# Altium schematic sheet SCH10_BBB_USB.SchDoc: Beaglebone Black - USB
size B; Organization: CWRUbotix; Address1: 10900 Euclid Avenue; Address2: Cleveland, OH 44106; Address3: USA; Revision: 1.0; SheetNumber: 10; SheetTotal: 13
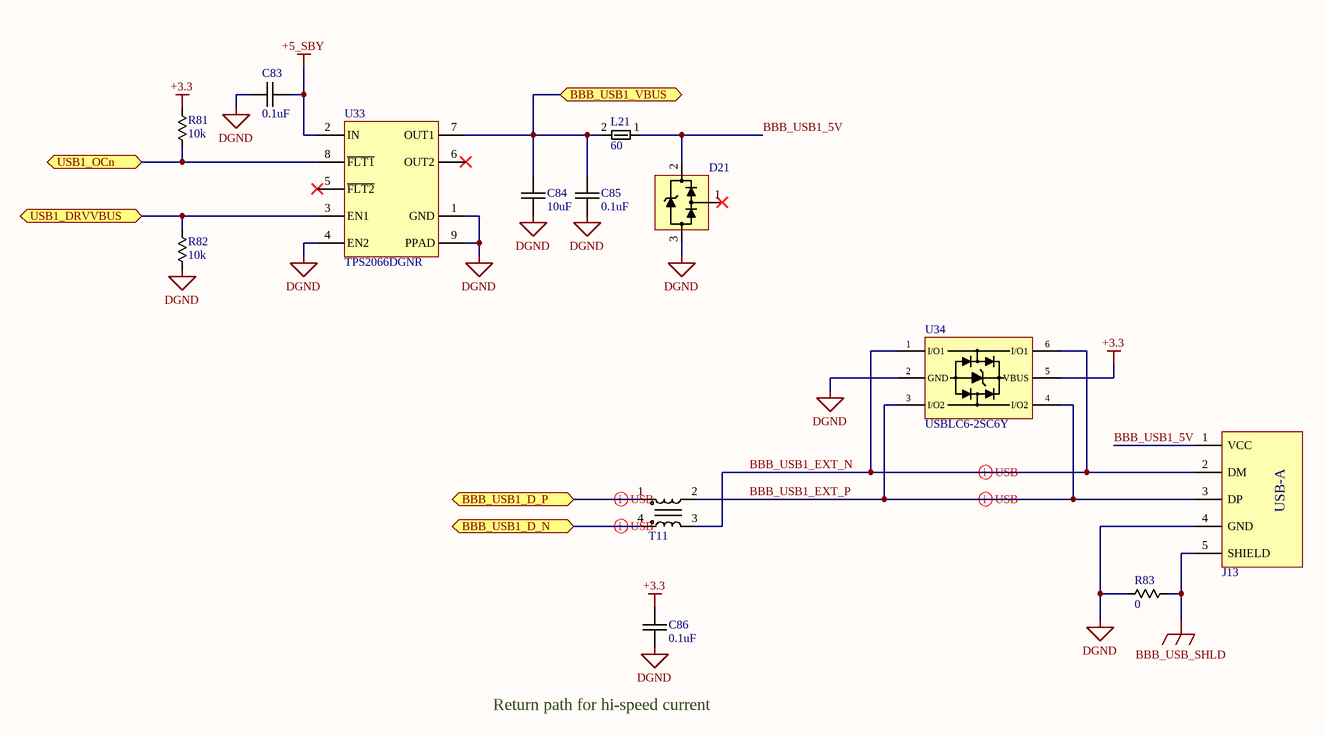
[diagram p0: SCH10_BBB_USB.SchDoc]

## Parts
C83  0.1uF  [chip_0603]
C84  10uF  [chip_1206]
C85  0.1uF  [chip_0603]
C86  0.1uF  [chip_0603]
D21  DLPT05  [sot-23-3]  (value not drawn)
J13  usb_a  [AMPHENOL_87583-3010RPALF]  (value not drawn)
L21  Impedance: 60  [CHIP_0805_FE]  (hidden comment: bead_0)
R81  10k  [chip_0603]
R82  10k  [chip_0603]
R83  0  [chip_0805]
T11  DLW21HN900SQ2L  [MURATA_DLW21H]  (value not drawn)
U33  TPS2066DGNR  [VSSOP-8-PPAD]
U34  USBLC6-2SC6Y  [sot-23-6]

## Ports
BBB_USB1_D_N (bidir), BBB_USB1_D_P (bidir), BBB_USB1_VBUS (bidir), USB1_DRVVBUS (bidir), USB1_OCn (bidir)

## Nets
+3.3: C86.1 R81.1 U34.5(VBUS)
+5_SBY: C83.1 U33.2(IN)
BBB_USB_SHLD: J13.5(SHIELD) R83.2
DGND: C83.2 C84.2 C85.1 C86.2 D21.3(GND) J13.4(GND) R82.2 R83.1 U33.1(GND) U33.4(EN2) U33.9(PPAD) U34.2(GND)
BBB_USB1_5V: D21.2(VCC) J13.1(VCC) L21.1
BBB_USB1_D_N: T11.4 ; port BBB_USB1_D_N
BBB_USB1_D_P: T11.1 ; port BBB_USB1_D_P
BBB_USB1_EXT_N: J13.2(DM) T11.3 U34.1(I/O1) U34.6(I/O1)
BBB_USB1_EXT_P: J13.3(DP) T11.2 U34.3(I/O2) U34.4(I/O2)
BBB_USB1_VBUS: C84.1 C85.2 L21.2 U33.7(OUT1) ; port BBB_USB1_VBUS
USB1_DRVVBUS: R82.1 U33.3(EN1) ; port USB1_DRVVBUS
USB1_OCn: R81.2 U33.8(~{FLT1}) ; port USB1_OCn

Not connected (* = marked no-connect by the designer): D21 1(LINE)*; U33 5(~{FLT2})* 6(OUT2)*

## Layout directives
differential pair: BBB_USB1_D_N, BBB_USB1_D_P, BBB_USB1_EXT_N, BBB_USB1_EXT_P

## Notes on the sheet
- Return path for hi-speed current
- Title
- Size:
- B
- Number:
- Revision:
- Date:
- Sheet
- of
- (in symbol CONN-00123) USB-A

## Library data of the parts
C83 C85 C86 = CAP-00542: CAP, 0.1uF, ±10%, 16V, X7R, 0603; Manufacturer: Murata; Part Number: CAP-00542; Capacitance: 0.1uF; Tolerance: ±10%; Voltage Rating: 16V; Type: X7R
C84 = CAP-00539: CAP, 10uF, ±10%, 25V, X7R, 1206; Manufacturer: Samsung; Manufacturer PN: CL31B106KAHNNNE; Part Number: CAP-00539; Capacitance: 10uF; Tolerance: ±10%; Voltage Rating: 25V; Type: X7R
D21 = DIO-00057: TVS, Steering (Rail-Rail), 9.8V Clamping, 17A Peak Pulse, SOT-23; Manufacturer: Diodes Incorporated; Manufacturer PN: DLPT05-7-F; Reverse Breakdown Voltage: 6.0V; Part Number: DIO-00057; Type: TVS; Cost: 0.38
J13 = CONN-00123: USB-A Receptacle x1, USB 2.0, Right-Angle, SMD; Manufacturer: Amphenol; Manufacturer PN: 87583-3010RPALF; Positions per level: 4; Levels: 1; Part Number: CONN-00123; Type: Receptacle; Cost: 0.89; Distributor Link: https://www.digikey.com/en/products/detail/amphenol-icc-fci/87583-3010RPALF/4266975
L21 = MAG-00125: Fe Bead, 60 @ 100MH, 3A, 0805; Manufacturer: Pulse Electronics; Manufacturer PN: PE-0805PFB600ST; Test Freq: 100MHz; DCR: 25mOhm; Part Number: MAG-00125; Current Rating: 3A; Cost: 0.1
R81 R82 = RES-00306: RES SMD 10K OHM 1% 1/4W 0603; Manufacturer: Panasonic; Manufacturer PN: ERJ-PA3F1002V; Power Rating: 0.25W; Part Number: RES-00306; Resistance: 10k; Tolerance: 1%; Cost: 0.144
R83 = RES-00720: RES SMD 0 OHM 1/8W 0805 Thick Film; Manufacturer: Stackpole; Manufacturer PN: RMCF0805ZT0R00; Tolerance: Jumper; Part Number: RES-00720; Resistance: 0; Power Rating: 1/8W; Cost: 0.1
T11 = MAG-00121: CMC, 330mA 2-CH 90 OHM @ 100MHz SMD; Manufacturer: Murata; Impedance: 90; DCR: 350mOhm; Part Number: MAG-00121; Test Freq: 100MHz; Manufacturer PN: DLW21HN900SQ2L; Cost: 0.53
U33 = PWREG-00052: IC, Power Switch 1:2, 8-MSOP; Manufacturer: TI; Voltage Range In: 2.7 ~ 5.5V; Max Current: 1A; Part Number: PWREG-00052; Voltage Range Out: 2.7 ~ 5.5V; Reg Type: Power Switch; Manufacturer PN: TPS2066DGNR; Cost: 1.56
U34 = DIO-00069: ESD Protec, 2-Ch, 2.5pF, 17V clamping voltage, SOT23-6; Manufacturer: ST; Forward Voltage: 1.1V; Reverse Breakdown Voltage: 6V; Current Rating: 5A; Part Number: DIO-00069; Type: TVS; Manufacturer PN: USBLC6-2SC6Y; Cost: 0.73